# EAGLE design TGE NEIL v1 (EAGLE 9.6.2)

## Sheet 1 of 5: TBEAM
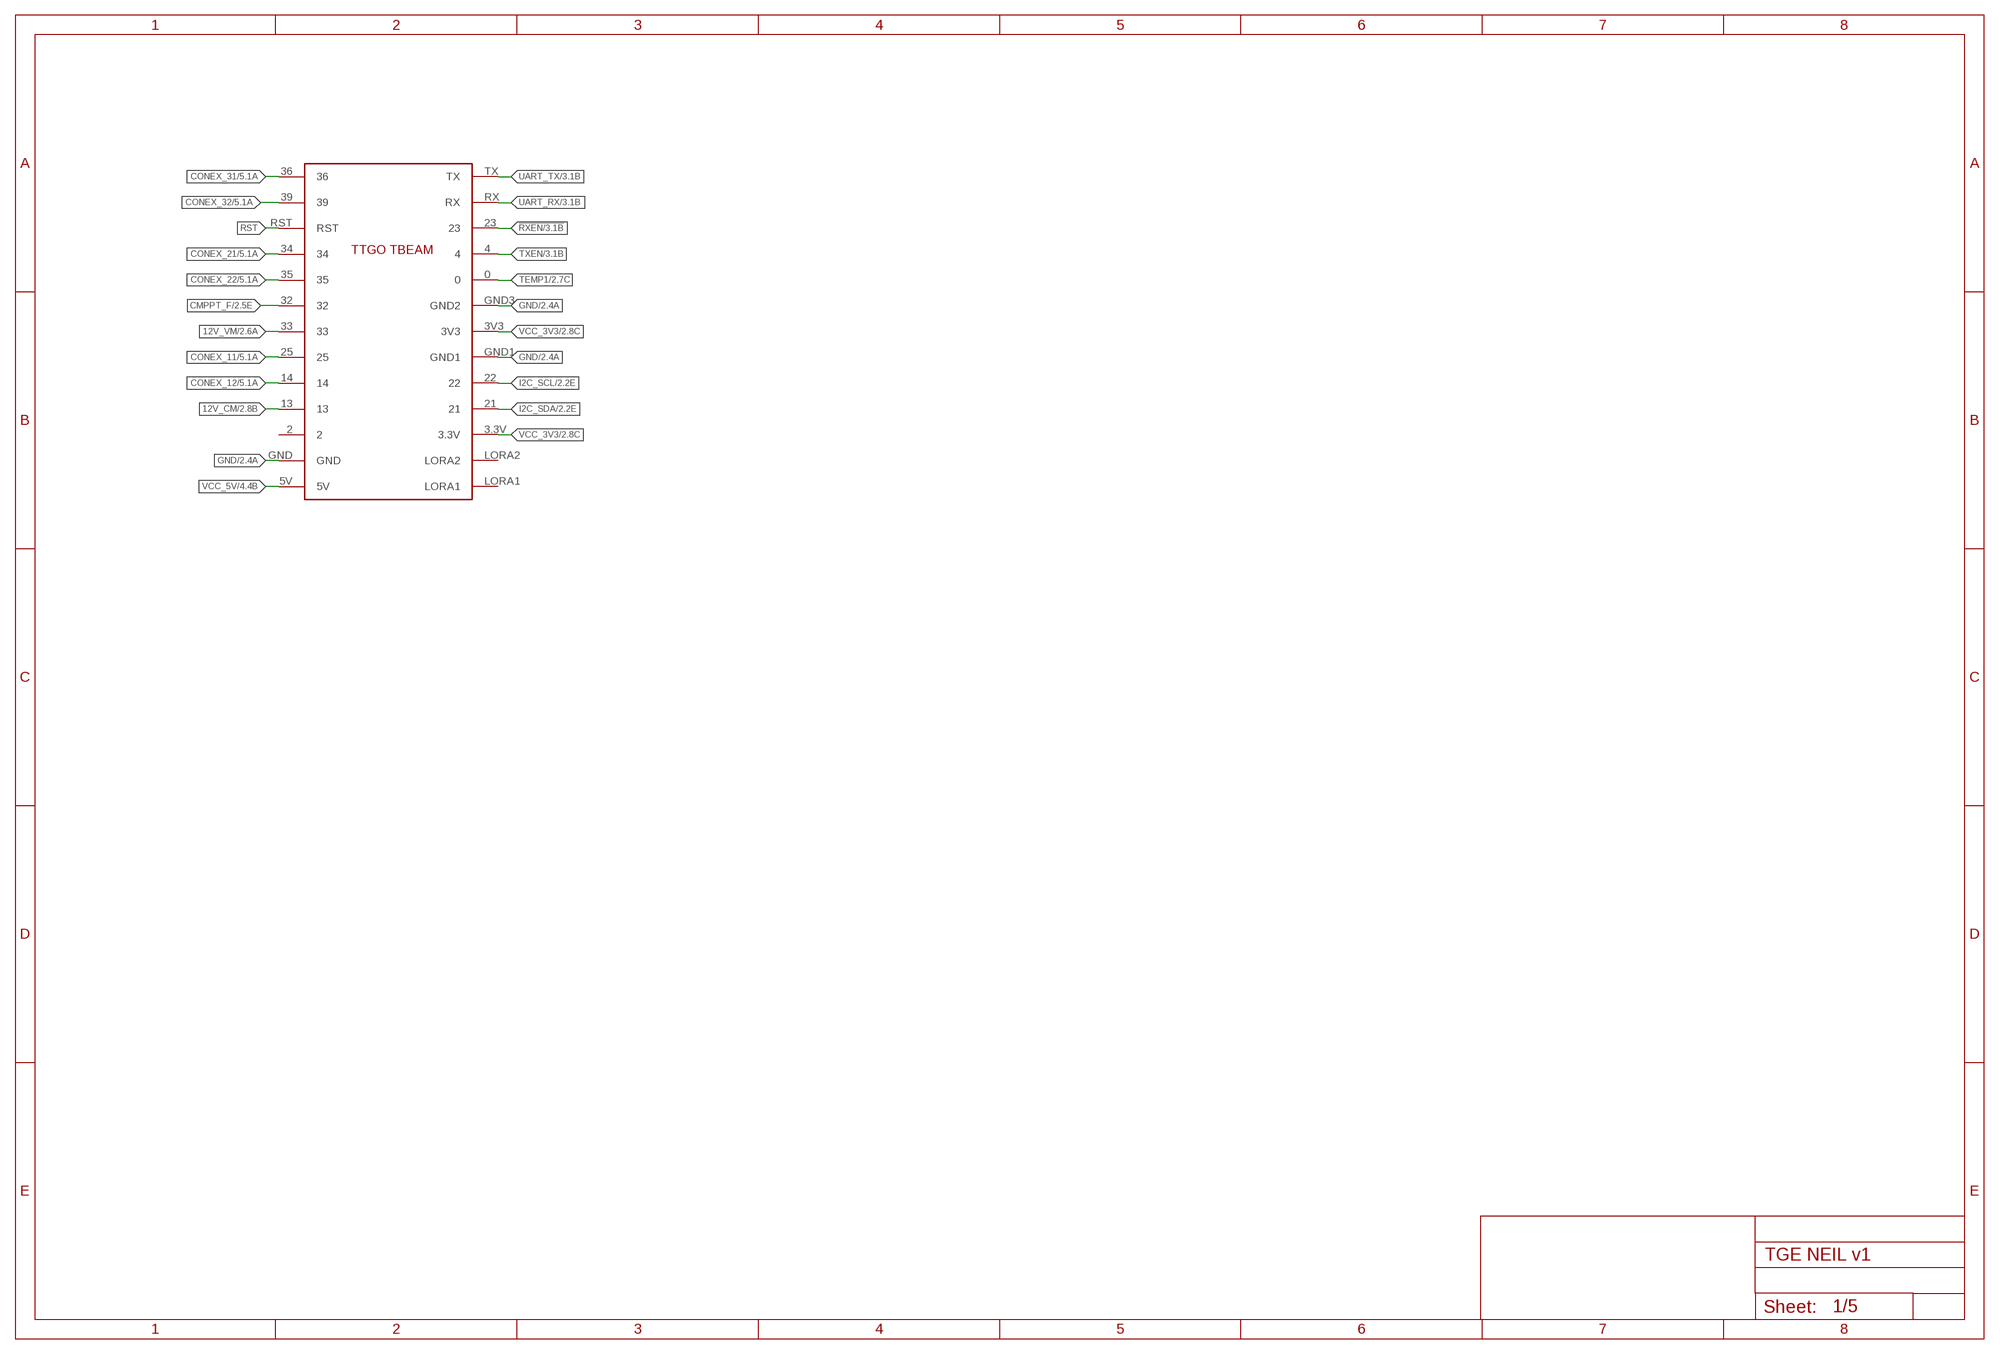
[diagram p0: schematic, sheet 1]

### Parts
U$1  TTGOBEAM  [TTGOBEAM]

### Nets
12V_CM: U$1.13 ; also sheet 2
12V_VM: U$1.33 ; also sheet 2
!RXEN: U$1.23 ; also sheet 3
CMPPT_F: U$1.32 ; also sheet 2
CONEX_11: U$1.25 ; also sheet 5
CONEX_12: U$1.14 ; also sheet 5
CONEX_21: U$1.34 ; also sheet 5
CONEX_22: U$1.35 ; also sheet 5
CONEX_31: U$1.36 ; also sheet 5
CONEX_32: U$1.39 ; also sheet 5
GND: U$1.GND U$1.GND1 U$1.GND3(GND2) ; also sheet 2,3,4,5
I2C_SCL: U$1.22 ; also sheet 2
I2C_SDA: U$1.21 ; also sheet 2
RST: U$1.RST
TEMP1: U$1.0 ; also sheet 2
TXEN: U$1.4 ; also sheet 3
UART_RX: U$1.RX ; also sheet 3
UART_TX: U$1.TX ; also sheet 3
VCC_3V3: U$1.3.3V U$1.3V3 ; also sheet 2,3,4
VCC_5V: U$1.5V ; also sheet 4,5
Unconnected: U$1.2 U$1.LORA1 U$1.LORA2

## Sheet 2 of 5: Analog Circuits
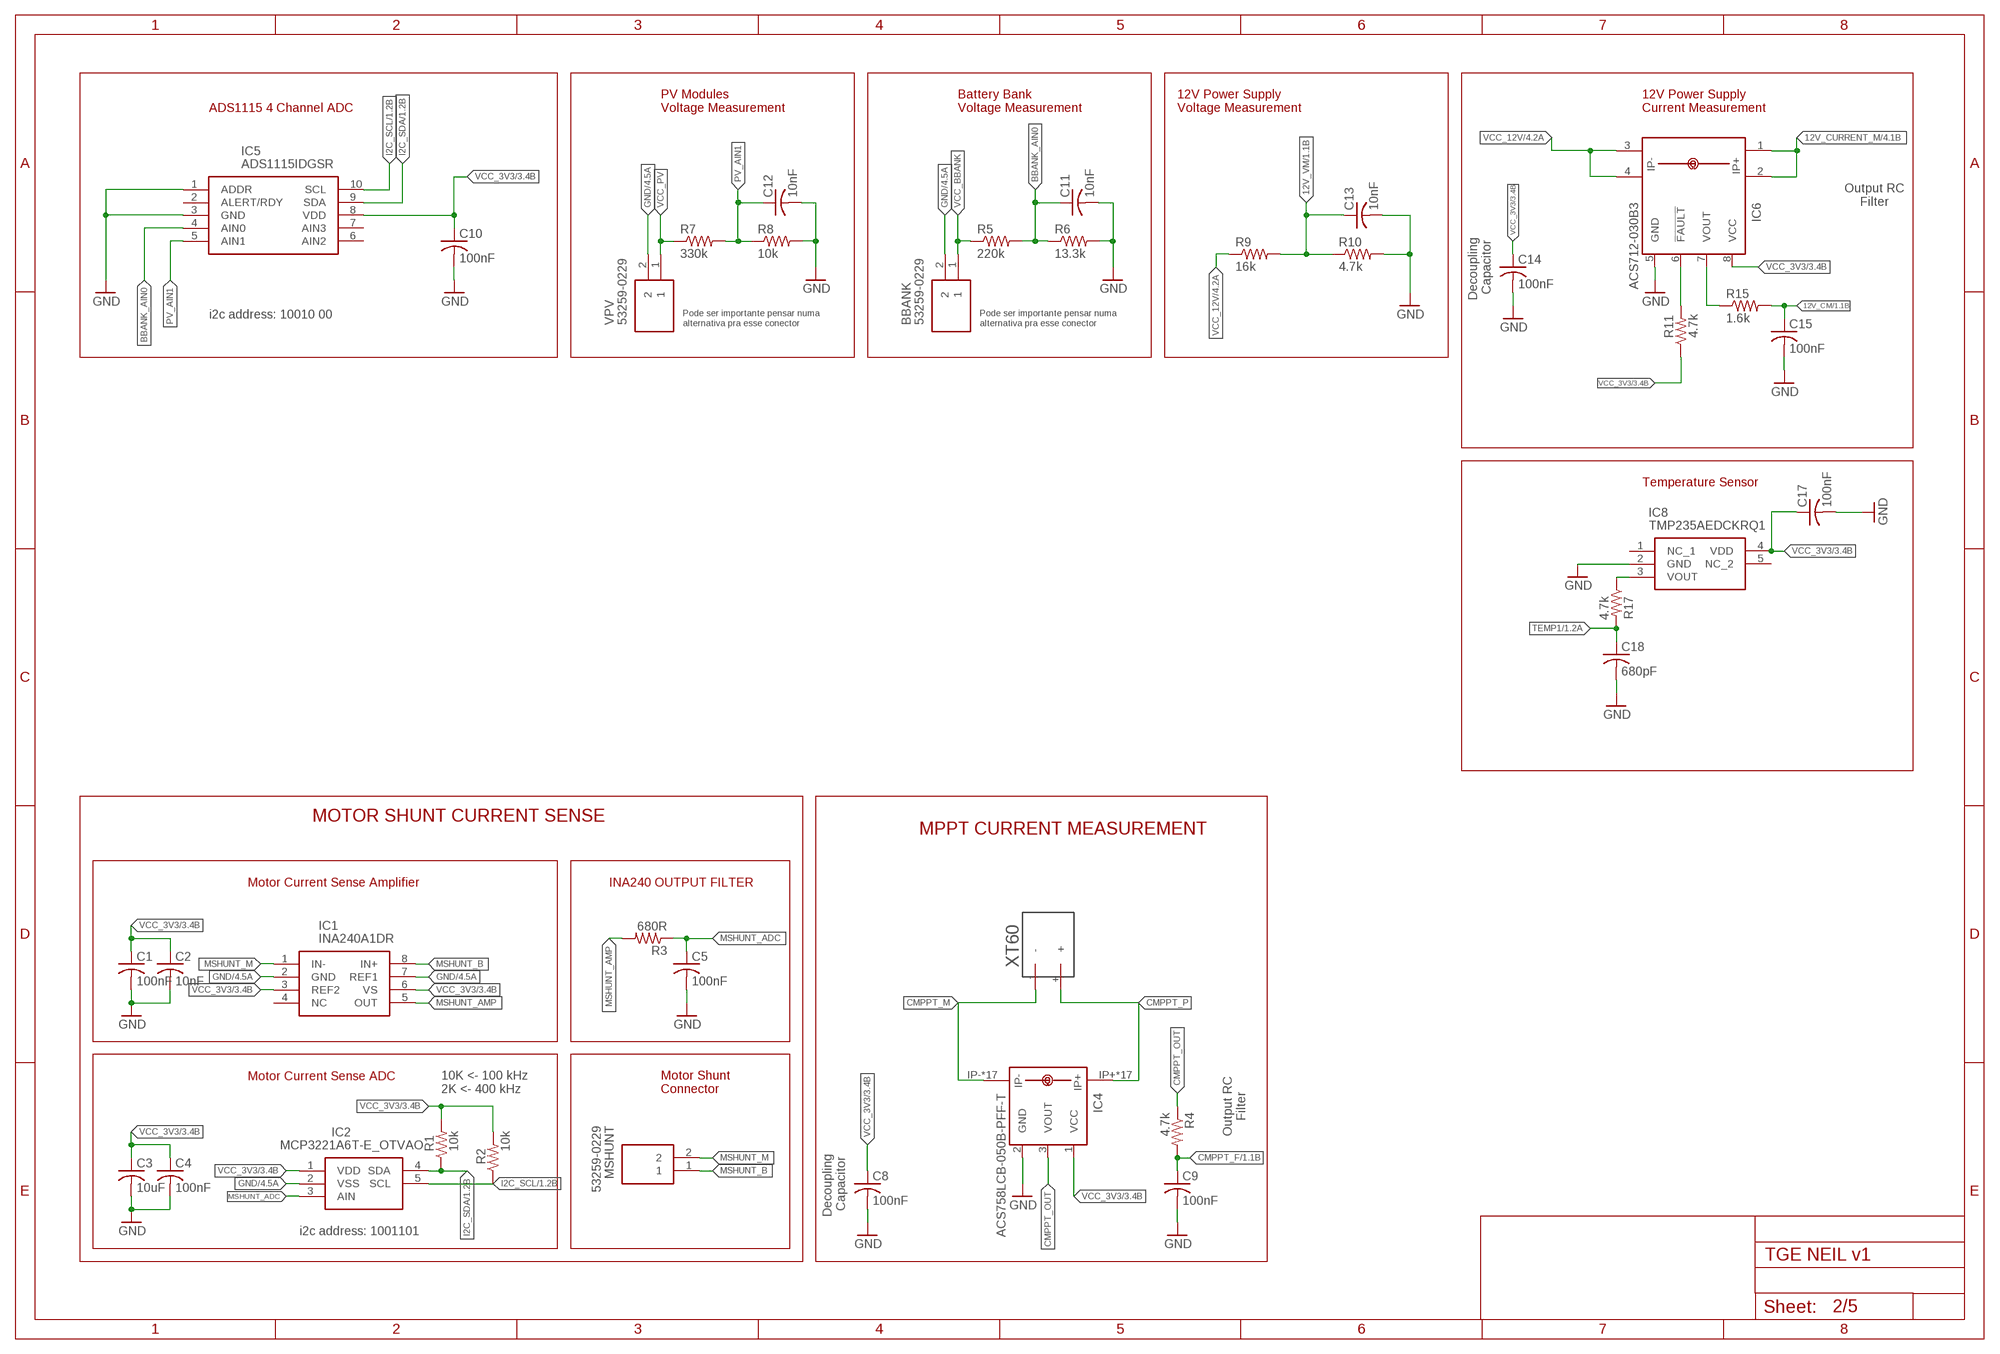
[diagram p1: schematic, sheet 2]

### Parts
BBANK  53259-0229  [0532590229]
C1  100nF  C-USC0805  [C0805]
C2  10nF  C-USC0805  [C0805]
C3  10uF  C-USC0805  [C0805]
C4  100nF  C-USC0805  [C0805]
C5  100nF  C-USC0805  [C0805]
C8  100nF  C-USC0805  [C0805]
C9  100nF  C-USC0805  [C0805]
C10  100nF  C-USC0805  [C0805]
C11  10nF  C-USC0805  [C0805]
C12  10nF  C-USC0805  [C0805]
C13  10nF  C-USC0805  [C0805]
C14  100nF  C-USC0805  [C0805]
C15  100nF  C-USC0805  [C0805]
C17  100nF  C-USC0805  [C0805]
C18  680pF  C-USC0805  [C0805]
IC1  INA240A1DR  [SOIC127P600X175-8N]
IC2  MCP3221A6T-E_OTVAO  [SOT95P280X145-5N]
IC4  ACS758LCB-050B-PFF-T  [CB-PFF]
IC5  ADS1115IDGSR  [SOP50P490X110-10N]
IC6  ACS712-030B3  ACS712-LC  [SOIC8]
IC8  TMP235AEDCKRQ1  [SOT65P210X110-5N]
MSHUNT  53259-0229  [0532590229]
R1  10k  R-US_R0805  [R0805]
R2  10k  R-US_R0805  [R0805]
R3  680R  R-US_R0805  [R0805]
R4  4.7k  R-US_R0805  [R0805]
R5  220k  R-US_R0805  [R0805]
R6  13.3k  R-US_R0805  [R0805]
R7  330k  R-US_R0805  [R0805]
R8  10k  R-US_R0805  [R0805]
R9  16k  R-US_R0805  [R0805]
R10  4.7k  R-US_R0805  [R0805]
R11  4.7k  R-US_R0805  [R0805]
R15  1.6k  R-US_R0805  [R0805]
R17  4.7k  R-US_R0805  [R0805]
U$3  XT60  [XT60]
VPV  53259-0229  [0532590229]

### Nets
12V_CM: C15.1 R15.2 ; also sheet 1
12V_CURRENT_M: IC6.1(IP+) IC6.2(IP+1) ; also sheet 4
12V_VM: C13.1 R9.2 R10.1 ; also sheet 1
BBANK_AIN0: C11.1 IC5.4(AIN0) R5.2 R6.1
CMPPT_F: C9.1 R4.2 ; also sheet 1
CMPPT_M: IC4.IP- IC4.IP-@2(IP-) IC4.IP-@3(IP-) IC4.IP-@4(IP-) IC4.IP-@5(IP-) IC4.IP-@6(IP-) IC4.IP-@7(IP-) IC4.IP-@8(IP-) IC4.IP-@9(IP-) IC4.IP-@10(IP-) IC4.IP-@11(IP-) IC4.IP-@12(IP-) IC4.IP-@13(IP-) IC4.IP-@14(IP-) IC4.IP-@15(IP-) IC4.IP-@16(IP-) IC4.IP-@17(IP-) U$3.-
CMPPT_OUT: IC4.3(VOUT) R4.1
CMPPT_P: IC4.IP+ IC4.IP+@2(IP+) IC4.IP+@3(IP+) IC4.IP+@4(IP+) IC4.IP+@5(IP+) IC4.IP+@6(IP+) IC4.IP+@7(IP+) IC4.IP+@8(IP+) IC4.IP+@9(IP+) IC4.IP+@10(IP+) IC4.IP+@11(IP+) IC4.IP+@12(IP+) IC4.IP+@13(IP+) IC4.IP+@14(IP+) IC4.IP+@15(IP+) IC4.IP+@16(IP+) IC4.IP+@17(IP+) U$3.+
GND: BBANK.2 C1.2 C2.2 C3.2 C4.2 C5.2 C8.2 C9.2 C10.2 C11.2 C12.2 C13.2 C14.2 C15.2 C17.2 C18.2 IC1.2(GND) IC1.7(REF1) IC2.2(VSS) IC4.2(GND) IC5.1(ADDR) IC5.3(GND) IC6.5(GND) IC8.2(GND) R6.2 R8.2 R10.2 VPV.2 ; also sheet 1,3,4,5
I2C_SCL: IC2.5(SCL) IC5.10(SCL) R2.1 ; also sheet 1
I2C_SDA: IC2.4(SDA) IC5.9(SDA) R1.1 ; also sheet 1
MSHUNT_ADC: C5.1 IC2.3(AIN) R3.1
MSHUNT_AMP: IC1.5(OUT) R3.2
MSHUNT_B: IC1.8(IN+) MSHUNT.1
MSHUNT_M: IC1.1(IN-) MSHUNT.2
N$1: IC6.6(!FAULT) R11.2
N$2: IC6.7(VOUT) R15.1
N$3: IC8.3(VOUT) R17.1
PV_AIN1: C12.1 IC5.5(AIN1) R7.2 R8.1
TEMP1: C18.1 R17.2 ; also sheet 1
VCC_3V3: C1.1 C2.1 C3.1 C4.1 C8.1 C10.1 C14.1 C17.1 IC1.3(REF2) IC1.6(VS) IC2.1(VDD) IC4.1(VCC) IC5.8(VDD) IC6.8(VCC) IC8.4(VDD) R1.2 R2.2 R11.1 ; also sheet 1,3,4
VCC_12V: IC6.3(IP-) IC6.4(IP-1) R9.1 ; also sheet 4
VCC_BBANK: BBANK.1 R5.1
VCC_PV: R7.1 VPV.1
Unconnected: IC1.4(NC) IC5.2(ALERT/RDY) IC5.6(AIN2) IC5.7(AIN3) IC8.1(NC_1) IC8.5(NC_2)

### Notes on the sheet
- ADS1115 4 Channel ADC
- PV Modules
  Voltage Measurement
- Battery Bank
  Voltage Measurement
- 12V Power Supply
  Voltage Measurement
- 12V Power Supply
  Current Measurement
- Output RC
  Filter
- Decoupling 
  Capacitor
- i2c address: 10010 00
- Pode ser importante pensar numa
  alternativa pra esse conector
- Pode ser importante pensar numa
  alternativa pra esse conector
- Temperature Sensor
- MOTOR SHUNT CURRENT SENSE
- MPPT CURRENT MEASUREMENT
- Motor Current Sense Amplifier | INA240 OUTPUT FILTER
- Motor Current Sense ADC
- 10K <- 100 kHz
  2K <- 400 kHz
- Motor Shunt 
  Connector
- Output RC
  Filter
- Decoupling 
  Capacitor
- i2c address: 1001101

## Sheet 3 of 5: Communication
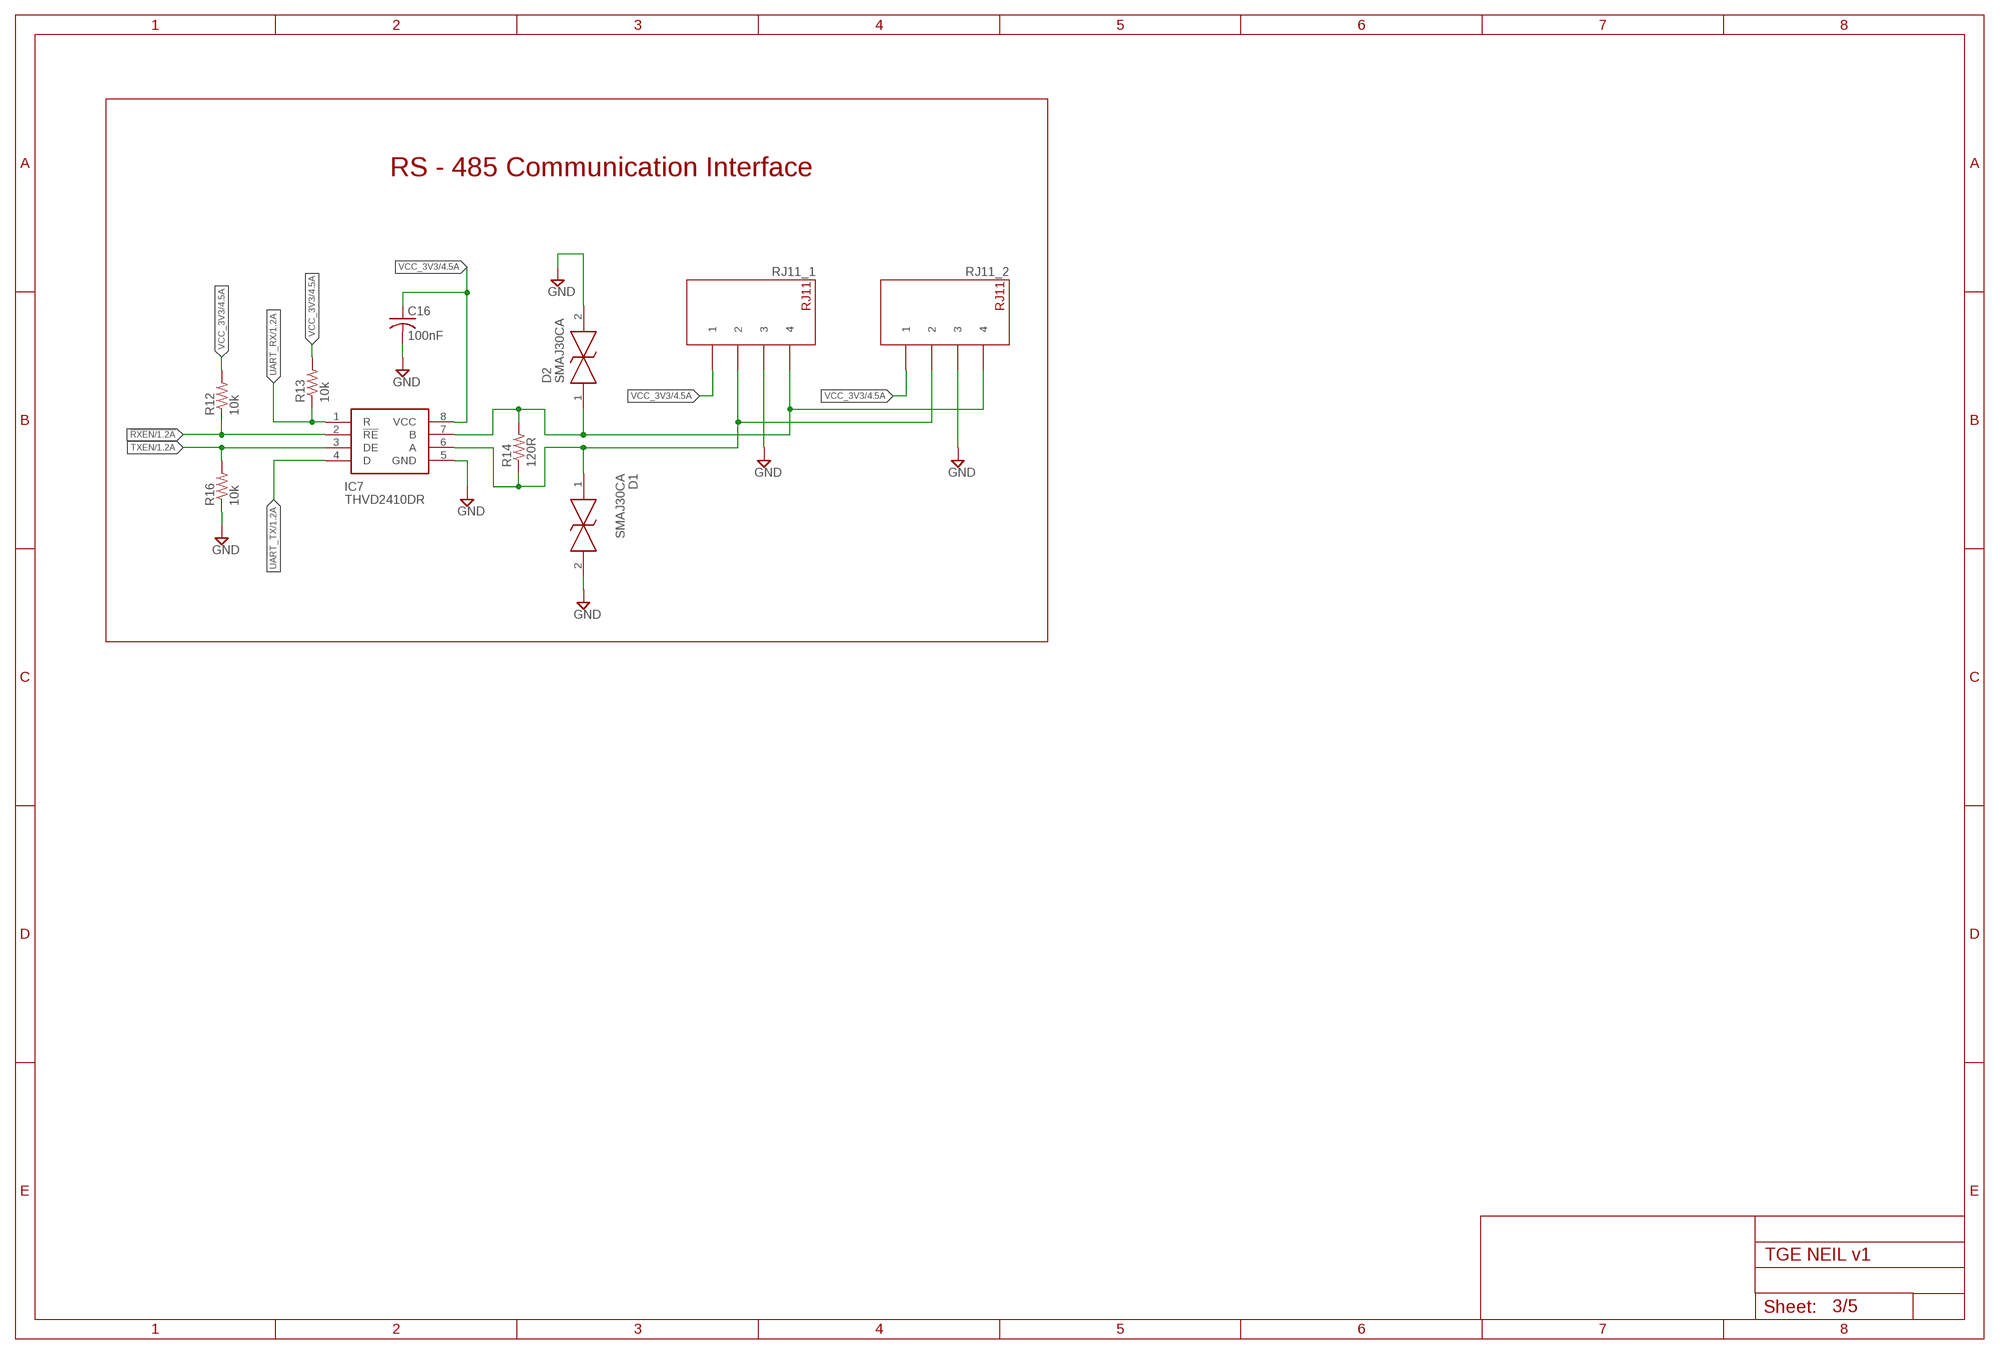
[diagram p2: schematic, sheet 3]

### Parts
C16  100nF  C-USC0805  [C0805]
D1  SMAJ30CA  [DIONM5026X229N]
D2  SMAJ30CA  [DIONM5026X229N]
IC7  THVD2410DR  [SOIC127P600X175-8N]
R12  10k  R-US_M0805  [M0805]
R13  10k  R-US_M0805  [M0805]
R14  120R  R-US_M0805  [M0805]
R16  10k  R-US_M0805  [M0805]
RJ11_1  TFC44  [TFC44]
RJ11_2  TFC44  [TFC44]

### Nets
!RXEN: IC7.2(!RE) R12.1 ; also sheet 1
GND: C16.2 D1.2 D2.2 IC7.5(GND) R16.1 RJ11_1.P$3 RJ11_2.P$3 ; also sheet 1,2,4,5
RS485_A: D1.1 IC7.6(A) R14.1 RJ11_1.P$2 RJ11_2.P$2
RS485_B: D2.1 IC7.7(B) R14.2 RJ11_1.P$4 RJ11_2.P$4
TXEN: IC7.3(DE) R16.2 ; also sheet 1
UART_RX: IC7.1(R) R13.1 ; also sheet 1
UART_TX: IC7.4(D) ; also sheet 1
VCC_3V3: C16.1 IC7.8(VCC) R12.2 R13.2 RJ11_1.P$1 RJ11_2.P$1 ; also sheet 1,2,4

### Notes on the sheet
- RS - 485 Communication Interface

## Sheet 4 of 5: Power
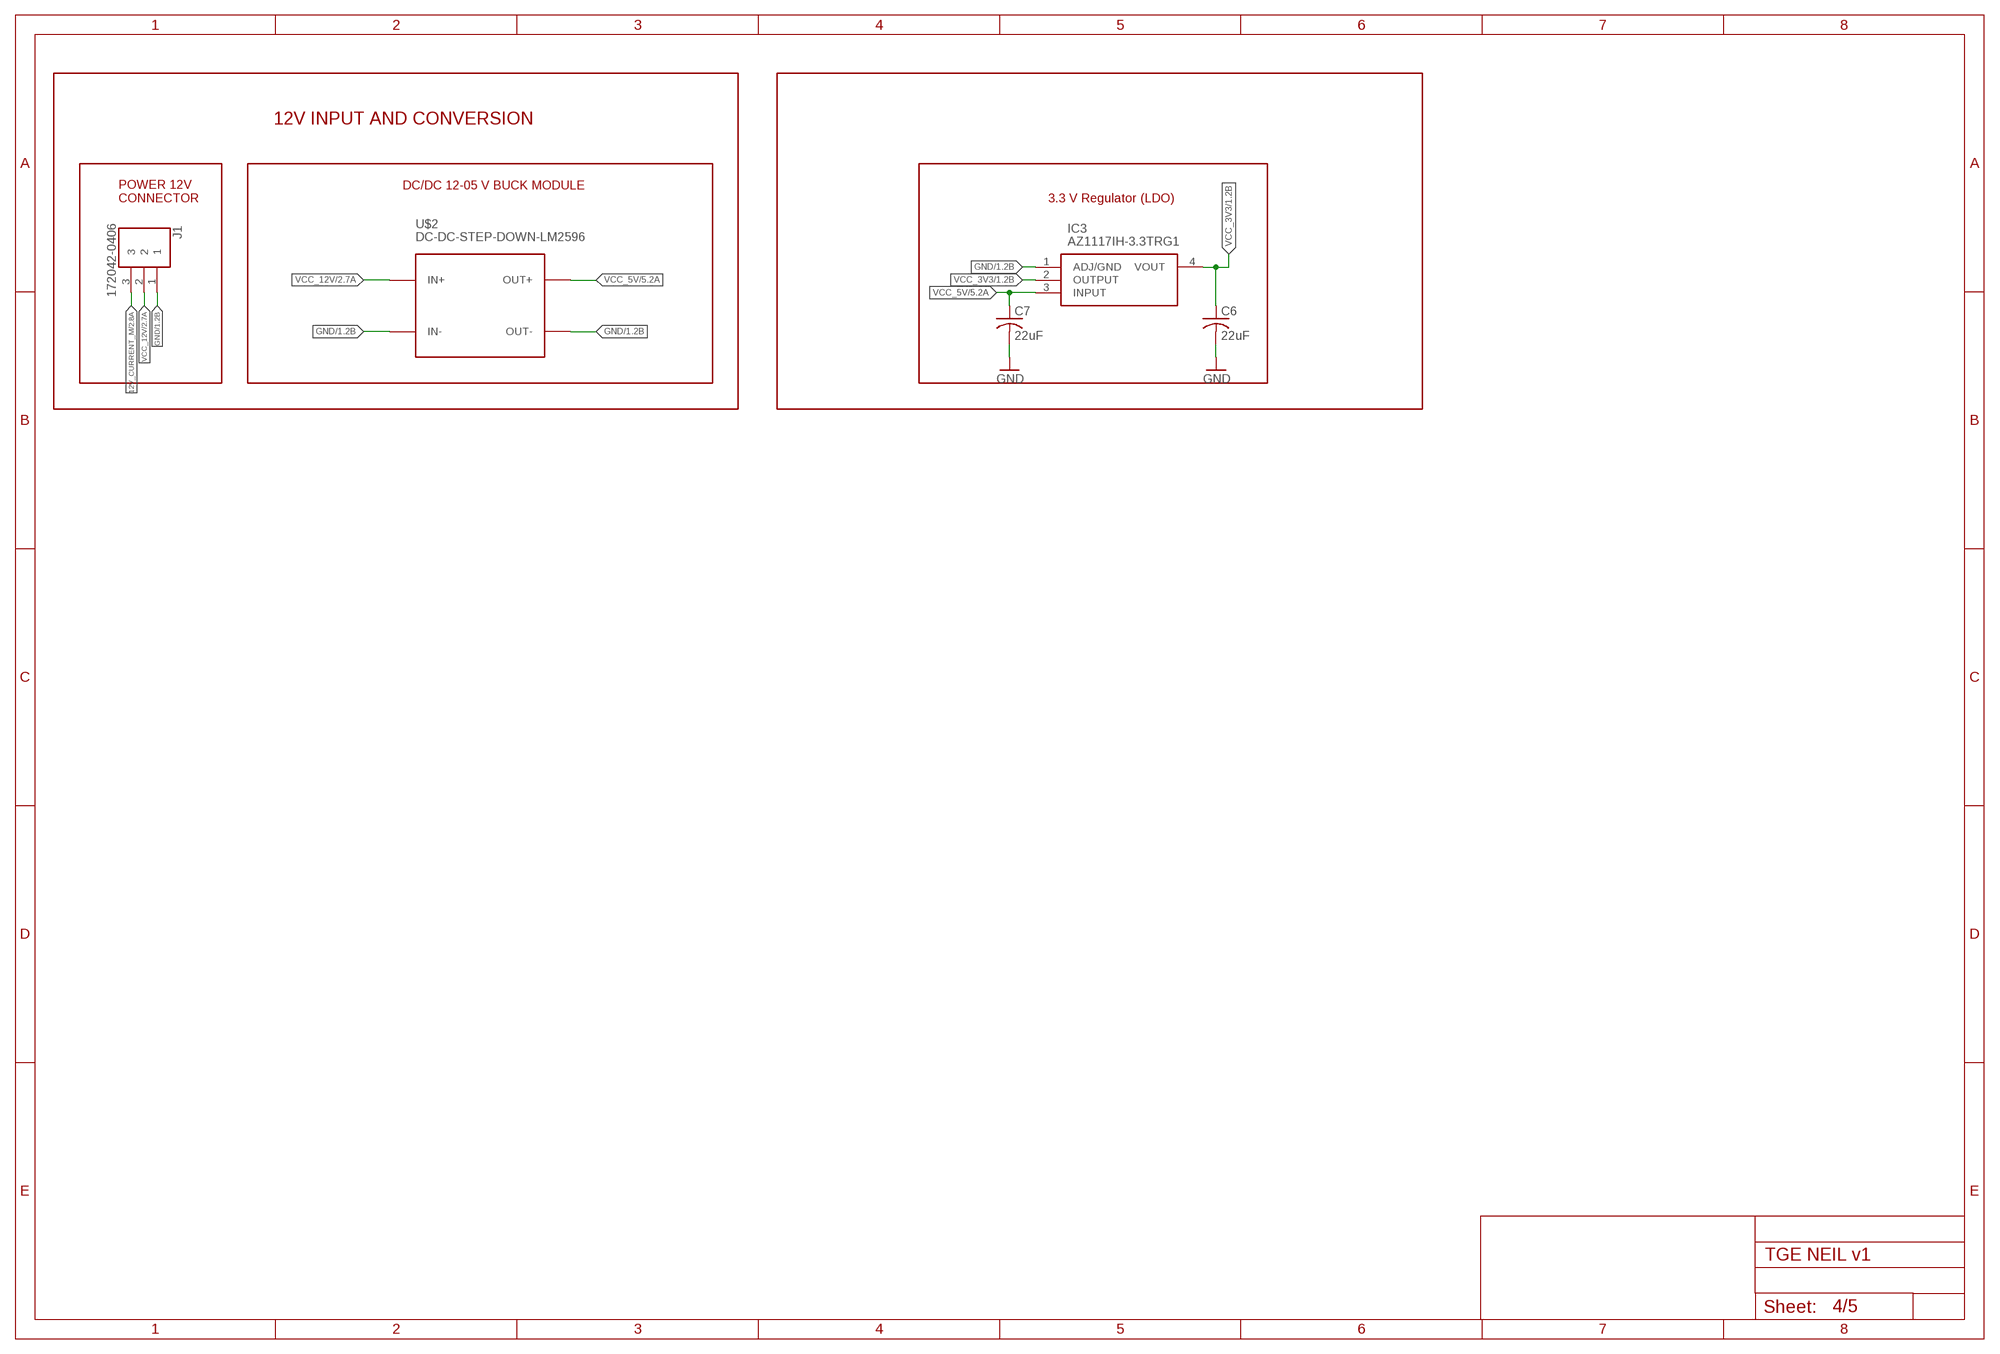
[diagram p3: schematic, sheet 4]

### Parts
C6  22uF  C-USC0805  [C0805]
C7  22uF  C-USC0805  [C0805]
IC3  AZ1117IH-3.3TRG1  [SOT230P700X170-4N]
J1  172042-0406  [MOLEX_172042-0406]
U$2  DC-DC-STEP-DOWN-LM2596  [DC-DC-STEP-DOWN-LM2596]

### Nets
12V_CURRENT_M: J1.3 ; also sheet 2
GND: C6.2 C7.2 IC3.1(ADJ/GND) J1.1 U$2.IN- U$2.OUT- ; also sheet 1,2,3,5
VCC_3V3: C6.1 IC3.2(OUTPUT) IC3.4(VOUT) ; also sheet 1,2,3
VCC_5V: C7.1 IC3.3(INPUT) U$2.OUT+ ; also sheet 1,5
VCC_12V: J1.2 U$2.IN+ ; also sheet 2

### Notes on the sheet
- 12V INPUT AND CONVERSION
- DC/DC 12-05 V BUCK MODULE
- POWER 12V
  CONNECTOR
- 3.3 V Regulator (LDO)

## Sheet 5 of 5: Extra Connectors
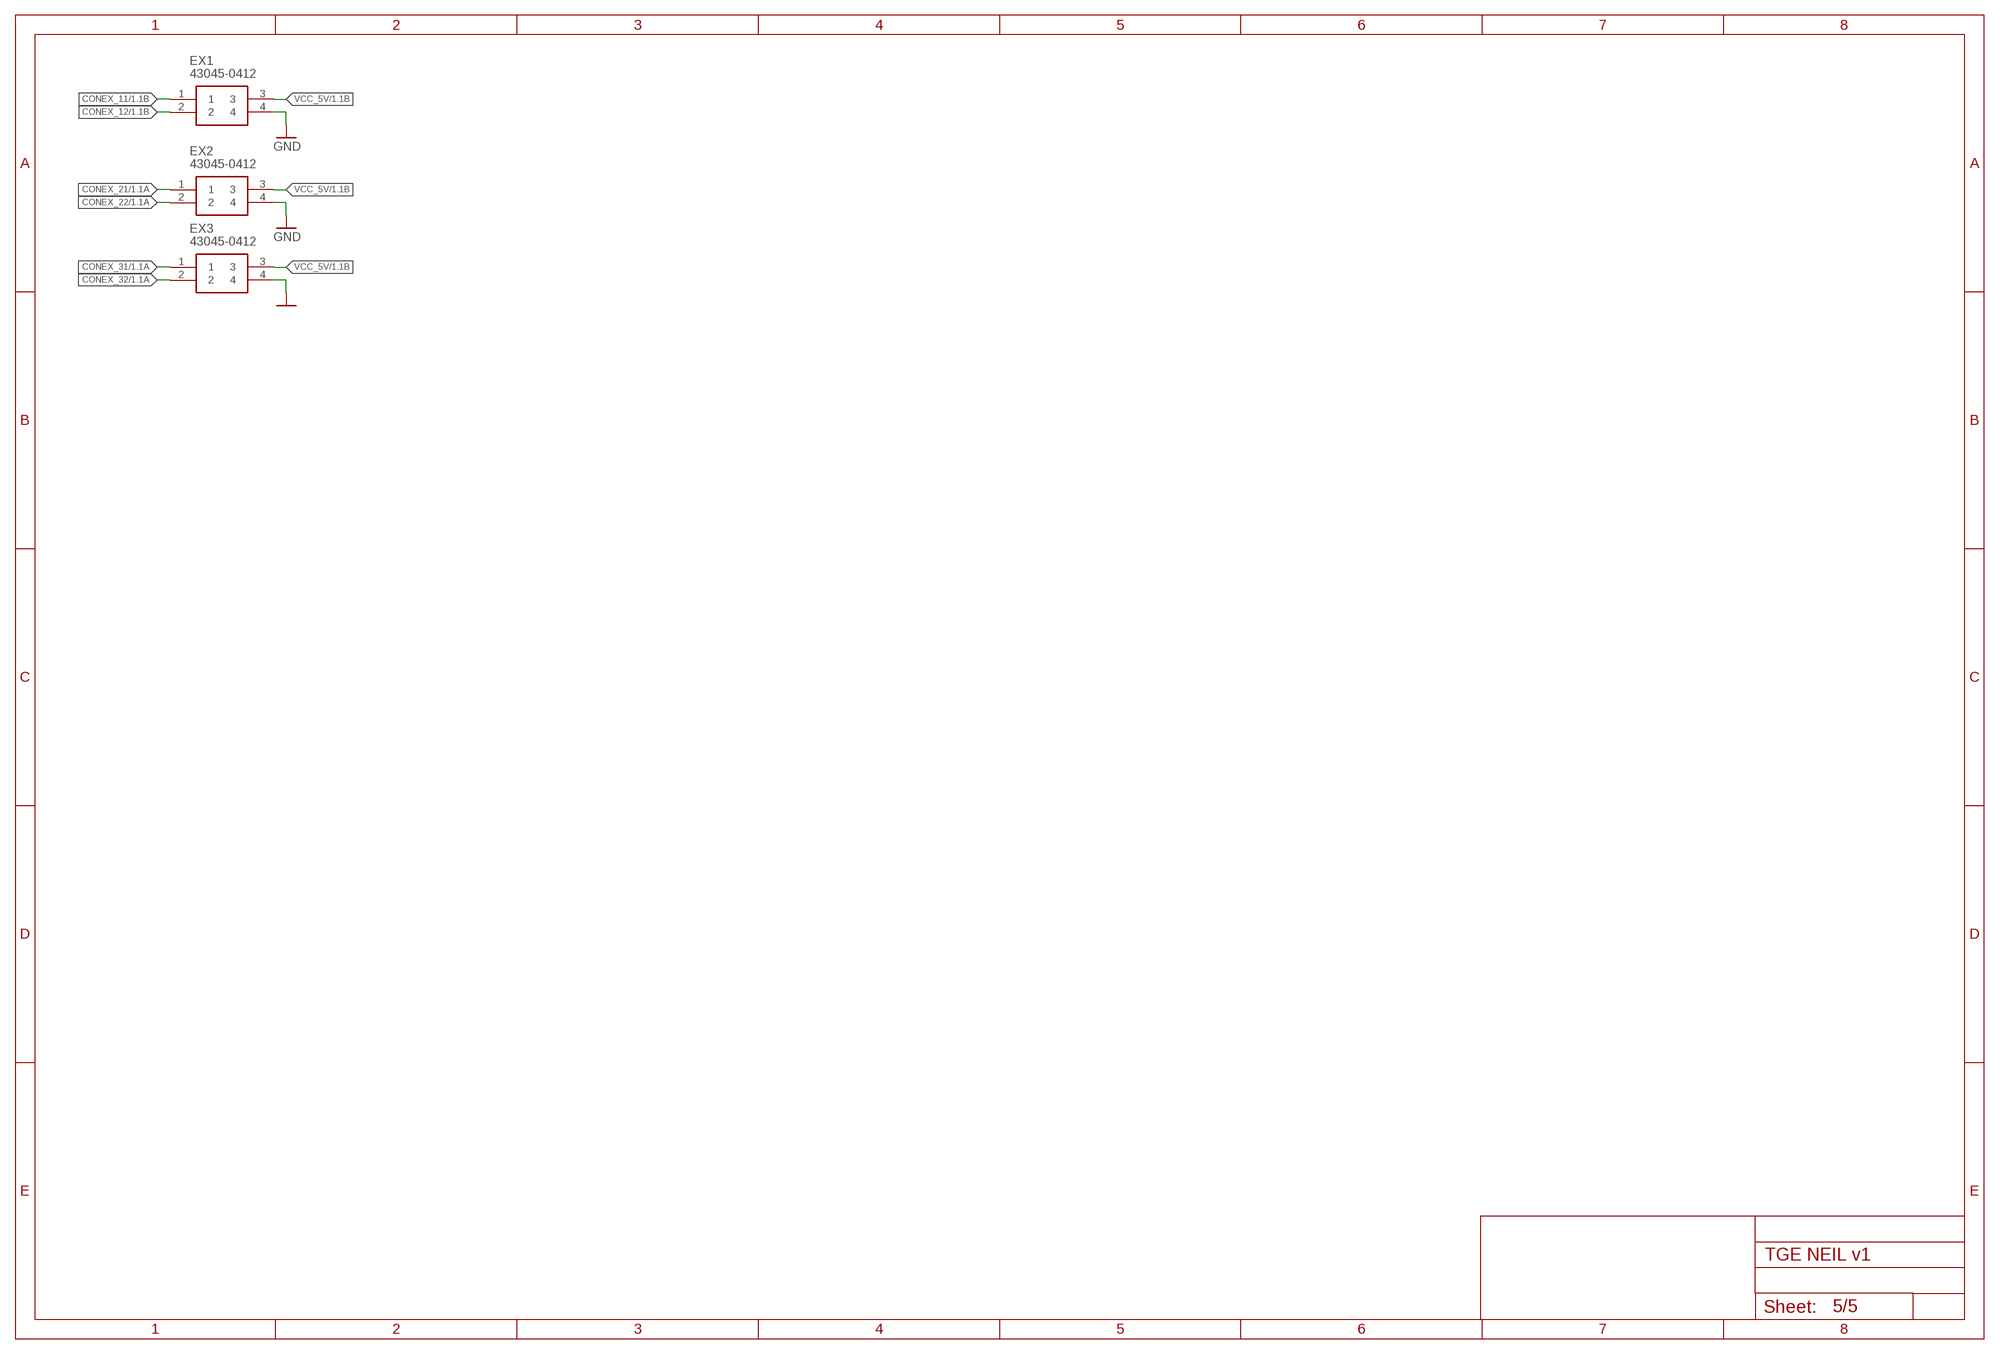
[diagram p4: schematic, sheet 5]

### Parts
EX1  43045-0412  [43045-0412]
EX2  43045-0412  [43045-0412]
EX3  43045-0412  [43045-0412]

### Nets
CONEX_11: EX1.1 ; also sheet 1
CONEX_12: EX1.2 ; also sheet 1
CONEX_21: EX2.1 ; also sheet 1
CONEX_22: EX2.2 ; also sheet 1
CONEX_31: EX3.1 ; also sheet 1
CONEX_32: EX3.2 ; also sheet 1
GND: EX1.4 EX2.4 EX3.4 ; also sheet 1,2,3,4
VCC_5V: EX1.3 EX2.3 EX3.3 ; also sheet 1,4

## Library data of the parts
BBANK MSHUNT VPV = CON_MOLEX_53259-0229:53259-0229: Headers & Wire Housings 3.5 WtB Wafer Assy R B Wafer Assy RA 2Ckt Source: Datasheet <https://www.molex.com/webdocs/datasheets/pdf/en-us/0532590229_PCB_HEADERS.pdf>; DESCRIPTION: Headers & Wire Housings 3.5 WtB Wafer Assy R B Wafer Assy RA 2Ckt; HEIGHT: 7mm; MANUFACTURER_NAME: Molex; MANUFACTURER_PART_NUMBER: 53259-0229; MOUSER_PART_NUMBER: 538-53259-0229; MOUSER_PRICE-STOCK: https://www.mouser.co.uk/ProductDetail/Molex/53259-0229?qs=%2Fy5FSpUmAiGN4PmFvaThpA%3D%3D
C1-C18 = rcl:C-US: CAPACITOR, American symbol; SPICEPREFIX: C
D1 D2 = SamacSys_Parts:SMAJ30CA: Littelfuse SMAJ30CA, Bi-Directional TVS Diode, 400W, 2-Pin DO-214AC Source: Datasheet <https://www.mouser.se/datasheet/2/240/Littelfuse_TVS_Diode_SMAJ_Datasheet.pdf-540740.pdf>; DESCRIPTION: Littelfuse SMAJ30CA, Bi-Directional TVS Diode, 400W, 2-Pin DO-214AC; HEIGHT: 2.29mm; MANUFACTURER_NAME: LITTELFUSE; MANUFACTURER_PART_NUMBER: SMAJ30CA; MOUSER_PART_NUMBER: 576-SMAJ30CA; MOUSER_PRICE-STOCK: https://www.mouser.co.uk/ProductDetail/Littelfuse/SMAJ30CA?qs=HR2RnyOI4E7JQai5qAA1IA%3D%3D
EX1-EX3 = SamacSys_Parts:43045-0412: Headers & Wire Housings 4 CKT VERT HEADER Source: Datasheet; DESCRIPTION: Headers & Wire Housings 4 CKT VERT HEADER; HEIGHT: mm; MANUFACTURER_NAME: Molex; MANUFACTURER_PART_NUMBER: 43045-0412; MOUSER_PART_NUMBER: 538-43045-0412; MOUSER_PRICE-STOCK: https://www.mouser.co.uk/ProductDetail/Molex/43045-0412?qs=UeCeOHRHQebPBbEMDLocEw%3D%3D
IC1 = INA240A1DR:INA240A1DR: 80V, Low-/High-Side, Bi-Directional, Zero-Drift, Current Sense Amp w/Enhanced PWM Rejection Source: Datasheet <http://www.ti.com/lit/gpn/ina240>; DESCRIPTION: 80V, Low-/High-Side, Bi-Directional, Zero-Drift, Current Sense Amp w/Enhanced PWM Rejection; HEIGHT: 1.75mm; MANUFACTURER_NAME: Texas Instruments; MANUFACTURER_PART_NUMBER: INA240A1DR; MOUSER_PART_NUMBER: 595-INA240A1DR; MOUSER_PRICE-STOCK: https://www.mouser.co.uk/ProductDetail/Texas-Instruments/INA240A1DR?qs=AQlKX63v8Rv7XB07RTzuHA%3D%3D
IC2 = MCP3221A6T-E_OTVAO:MCP3221A6T-E_OTVAO: Analog to Digital Converters - ADC Automotive, 12-bit SAR ADC, I2C, single channel Source: Datasheet <https://www.arrow.com/en/products/mcp3221a6t-eotvao/microchip-technology>; DESCRIPTION: Analog to Digital Converters - ADC Automotive, 12-bit SAR ADC, I2C, single channel; HEIGHT: 1.45mm; MANUFACTURER_NAME: Microchip; MANUFACTURER_PART_NUMBER: MCP3221A6T-E/OTVAO; MOUSER_PART_NUMBER: 579-MCP3221A6TEOTVAO; MOUSER_PRICE-STOCK: https://www.mouser.co.uk/ProductDetail/Microchip-Technology/MCP3221A6T-E-OTVAO?qs=5aG0NVq1C4xIe7K3D%2FHE6g%3D%3D
IC3 = AZ1117IH-3.3TRG1:AZ1117IH-3.3TRG1: LDO Voltage Regulators LDO BJT HiCurr 1.35A 10Hz to 10KHz Source: Datasheet; DESCRIPTION: LDO Voltage Regulators LDO BJT HiCurr 1.35A 10Hz to 10KHz; HEIGHT: 1.7mm; MANUFACTURER_NAME: Diodes Inc.; MANUFACTURER_PART_NUMBER: AZ1117IH-3.3TRG1; MOUSER_PART_NUMBER: 621-AZ1117IH-3.3TRG1; MOUSER_PRICE-STOCK: https://www.mouser.co.uk/ProductDetail/Diodes-Incorporated/AZ1117IH-33TRG1?qs=cpo3%2FpBou2jnS4SxLgAVoA%3D%3D
IC4 = allegro:ACS758*: Thermally Enhanced, Fully Integrated, Hall Effect-Based Linear Current Sensor with 100 micro Ohm Current Conductor display layer 49 Reference in BRD and place VIAs on circles Source: http://www.allegromicro.com/en/Products/Part_Numbers/0758/0758.pdf; MPN: ACS758LCB-050B-PFF-T; OC_FARNELL: 1718997; OC_NEWARK: 04R7131
IC5 = SamacSys_Parts:ADS1115IDGSR: 16-Bit 860SPS 4-Ch Delta-Sigma ADC With PGA, Oscillator, Vref, Comparator, and I2C Source: Datasheet <http://www.ti.com/lit/gpn/ADS1115>; DESCRIPTION: 16-Bit 860SPS 4-Ch Delta-Sigma ADC With PGA, Oscillator, Vref, Comparator, and I2C; HEIGHT: 1.1mm; MANUFACTURER_NAME: Texas Instruments; MANUFACTURER_PART_NUMBER: ADS1115IDGSR; MOUSER_PART_NUMBER: 595-ADS1115IDGSR; MOUSER_PRICE-STOCK: https://www.mouser.co.uk/ProductDetail/Texas-Instruments/ADS1115IDGSR?qs=IK5e5L0zOXjKCJoVMhYO%2FQ%3D%3D
IC6 = allegro-2:ACS712-LC
IC7 = SamacSys_Parts:THVD2410DR: RS-485 Interface IC Source: Datasheet <https://www.ti.com/lit/ds/symlink/thvd2410.pdf>; DESCRIPTION: RS-485 Interface IC; HEIGHT: 1.75mm; MANUFACTURER_NAME: Texas Instruments; MANUFACTURER_PART_NUMBER: THVD2410DR; MOUSER_PART_NUMBER: 595-THVD2410DR; MOUSER_PRICE-STOCK: https://www.mouser.co.uk/ProductDetail/Texas-Instruments/THVD2410DR?qs=%252B6g0mu59x7L2L8jrQVCEYQ%3D%3D
IC8 = SamacSys_Parts:TMP235AEDCKRQ1: Board Mount Temperature Sensors Automotive grade, +/-0.5C analog output temperature sensor with 10 mV/C gain 5-SC70 -40 to 150 Source: Datasheet <https://www.ti.com/lit/gpn/TMP235-Q1>; DESCRIPTION: Board Mount Temperature Sensors Automotive grade, +/-0.5C analog output temperature sensor with 10 mV/C gain 5-SC70 -40 to 150; HEIGHT: 1.1mm; MANUFACTURER_NAME: Texas Instruments; MANUFACTURER_PART_NUMBER: TMP235AEDCKRQ1; MOUSER_PART_NUMBER: 595-TMP235AEDCKRQ1; MOUSER_PRICE-STOCK: https://www.mouser.co.uk/ProductDetail/Texas-Instruments/TMP235AEDCKRQ1?qs=T3oQrply3y86j8c6PmMwyA%3D%3D
J1 = 172042-0302:172042-0406: Super Sabre™ Vertical Header, 3 Circuit, Short Tail with Board Lock, Complies with the UL1977 finger proof stan; AVAILABILITY: Warning; DESCRIPTION: 3 Position Header, Male Blades Connector Solder 0.295 (7.50mm) Through Hole; MF: Molex; MP: 172042-0302; PACKAGE: None; PRICE: None
R1-R17 = rcl:R-US_: RESISTOR, American symbol; SPICEPREFIX: R
RJ11_1 RJ11_2 = Painel-Facilidades:TFC44
U$1 = bibliotecattgo:TTGOBEAM
U$2 = diy-modules:DC-DC-STEP-DOWN-LM2596: DC/DC Step-Down Regulator based on LM2596-ADJ chip LM2596 datasheet available here: http://www.ti.com/lit/ds/symlink/lm2596.pdf Click here to find device on ebay.com <http://www.ebay.com/sch/lm2596+power+regulator>
U$3 = XT60:XT60: XT60

## Board
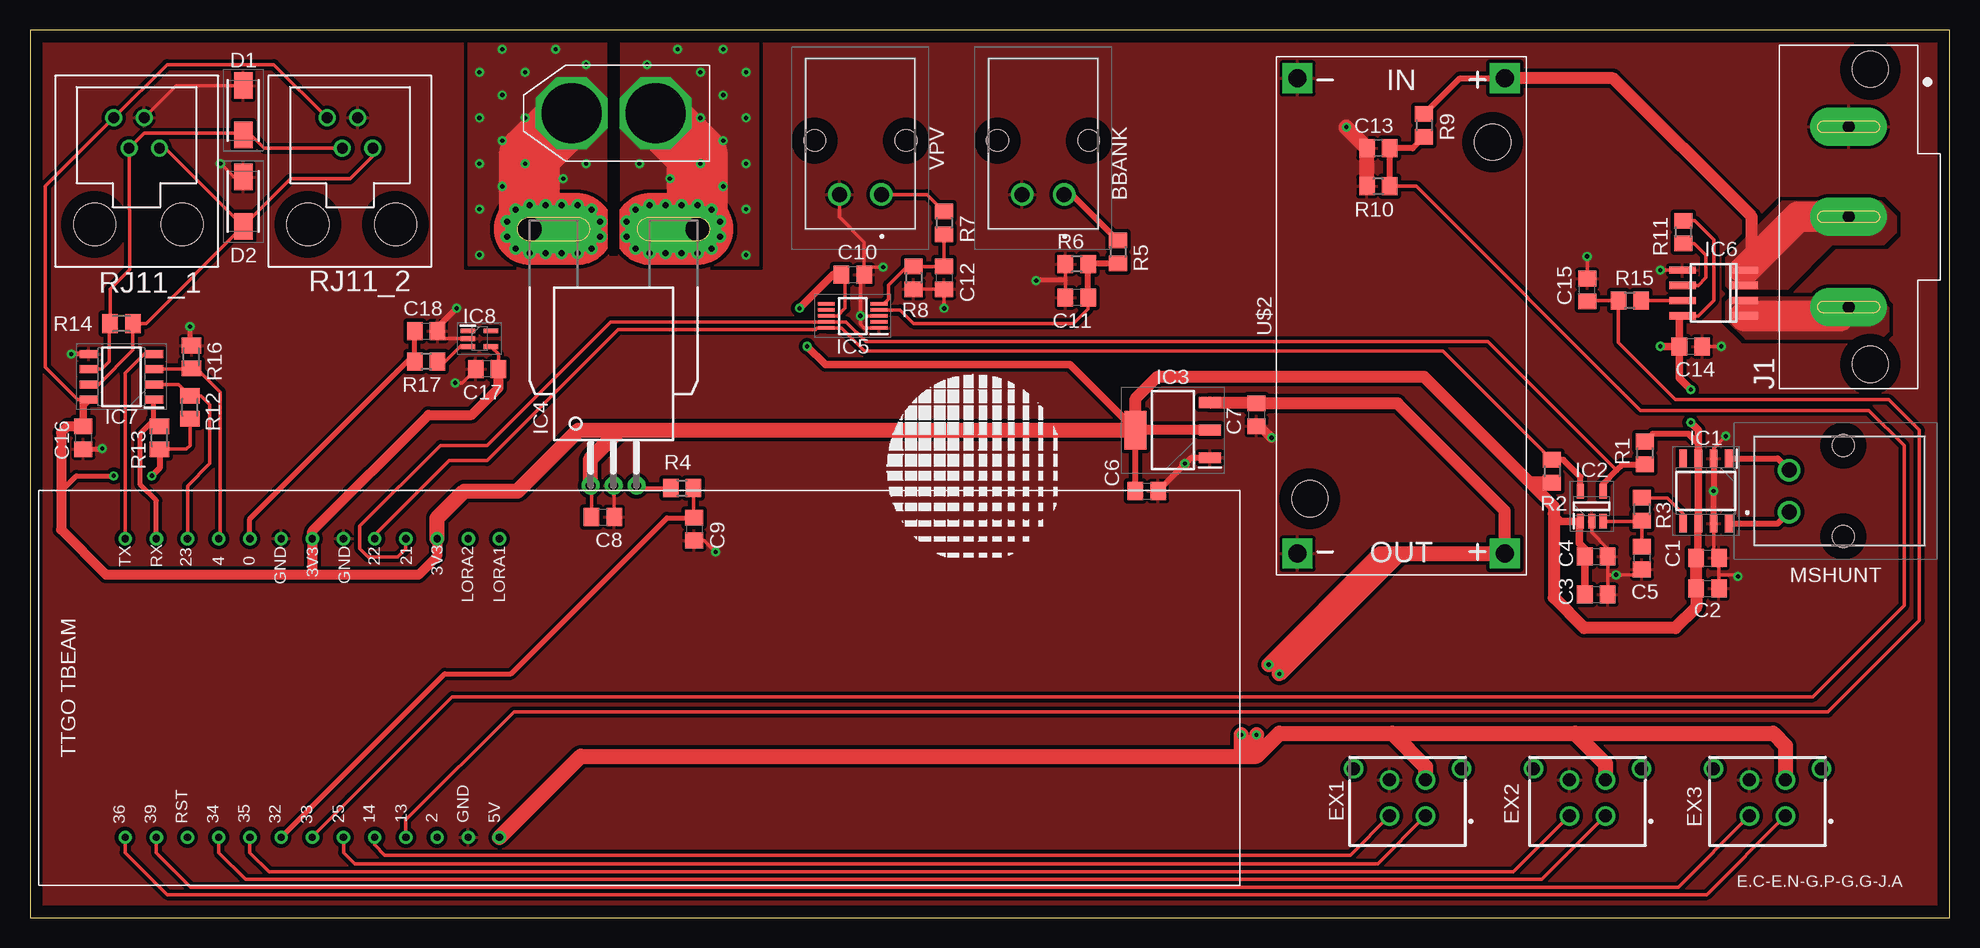
[diagram p5: board, top side]
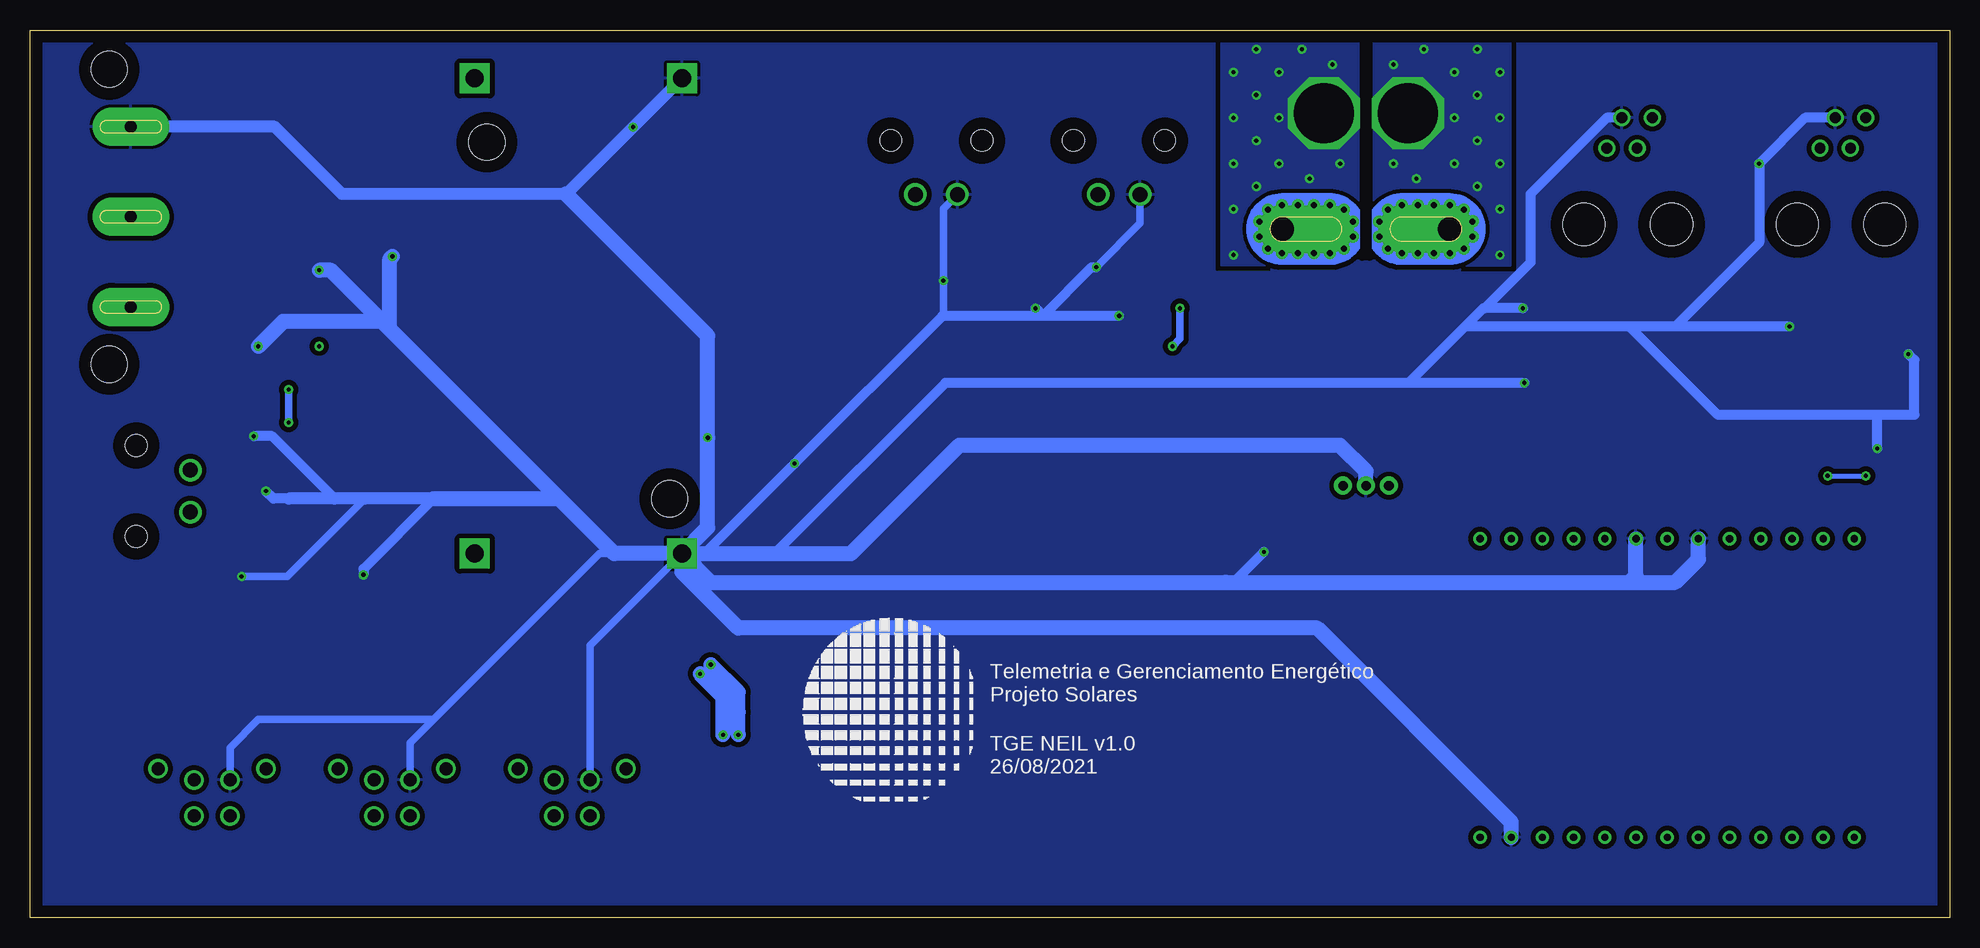
[diagram p6: board, bottom side, seen from below]

Size 160 x 74 mm. Coordinates in mm from the lower left corner, seen from the top.
Outline: 0,0 160,0 160,74 0,74 0,0
Copper layers (1*16): Top 0.07mm / dielectric 1.5mm / Bottom 0.07mm
Design rules "default *": minimum track width 12mil, minimum drill 0.35mm, track to track 12mil, track to pad 16mil, pad to pad 5mil, via to via 16mil, smd to smd 5mil, copper to edge 40mil, drill to drill 6mil, minimum pad ring 10mil, minimum via ring 8mil, stop-mask expansion 4mil, vias tented up to drill 0mil, thermal gap 10mil

### Footprints (pad centres in the part's own frame; a part is rotated, then mirrored left to right if it is on the bottom)
0532590229 = drill 1.25 pad 1.875: 1 -1.75,3.85; 2 1.75,3.85 | hole 1.8: 3.8,-0.65; -3.8,-0.65
C0805 = smd 1.3 x 1.5: 1 -0.95,0; 2 0.95,0
DIONM5026X229N = smd 2.2 x 1.55: 1 -2.05,0; 2 2.05,0
43045-0412 = drill 1.07 pad 1.62: 1 6.325,2.47; 2 3.325,2.47; 3 6.325,5.47; 4 3.325,5.47; 5 0.325,6.41; 6 9.325,6.41
SOIC127P600X175-8N = smd 1.528 x 0.65: 1 -2.711,1.905; 2 -2.711,0.635; 3 -2.711,-0.635; 4 -2.711,-1.905; 5 2.711,-1.905; 6 2.711,-0.635; 7 2.711,0.635; 8 2.711,1.905
SOT95P280X145-5N = smd 1.2 x 0.6: 1 -1.25,0.95; 2 -1.25,0; 3 -1.25,-0.95; 4 1.25,-0.95; 5 1.25,0.95
SOT230P700X170-4N = smd 1.85 x 0.9: 1 -3.1,2.3; 2 -3.1,0; 3 -3.1,-2.3 | smd 1.85 x 3.2: 4 3.1,0
CB-PFF = drill 0.8 pad 1.5: 1 -1.91,-21.4; 2 0,-21.4; 3 1.91,-21.4 | drill 2 pad 4 offset: IP+ 7,0; IP- -7,0 | drill 0.5 pad 0.9: IP+@2 8.89,0.635; IP+@3 8.89,-0.635; IP+@4 8.175,-1.625; IP+@5 7,-2; IP+@6 5.675,-2; IP+@7 4.35,-2; IP+@8 3,-2; IP+@9 1.825,-1.625; IP+@10 1.1,-0.625; IP+@11 1.1,0.625; IP+@12 1.825,1.625; IP+@13 3,2; IP+@14 4.35,2; IP+@15 5.675,2; IP+@16 7,2; IP+@17 8.175,1.625; IP-@2 -8.89,0.635; IP-@3 -8.89,-0.635; IP-@4 -8.175,-1.625; IP-@5 -7,-2; IP-@6 -5.675,-2; IP-@7 -4.325,-2; IP-@8 -3,-2; IP-@9 -1.825,-1.625; IP-@10 -1.1,-0.625; IP-@11 -1.1,0.625; IP-@12 -1.825,1.625; IP-@13 -3,2; IP-@14 -4.325,2; IP-@15 -5.675,2; IP-@16 -7,2; IP-@17 -8.175,1.625
SOP50P490X110-10N = smd 1.4 x 0.3: 1 -2.2,1; 2 -2.2,0.5; 3 -2.2,0; 4 -2.2,-0.5; 5 -2.2,-1; 6 2.2,-1; 7 2.2,-0.5; 8 2.2,0; 9 2.2,0.5; 10 2.2,1
SOIC8 = smd 0.6 x 2.2: 1 -1.905,-2.6; 2 -0.635,-2.6; 3 0.635,-2.6; 4 1.905,-2.6; 5 1.905,2.6; 6 0.635,2.6; 7 -0.635,2.6; 8 -1.905,2.6
SOT65P210X110-5N = smd 1.2 x 0.4: 1 -0.95,0.65; 2 -0.95,0; 3 -0.95,-0.65; 4 0.95,-0.65; 5 0.95,0.65
MOLEX_172042-0406 = drill 1 pad 3.2 long: 1 7.508,2.075; 2 0,2.075; 3 -7.508,2.075 | hole 3: 12.298,0.27; -12.298,0.27
R0805 = smd 1.3 x 1.5: 1 -0.95,0; 2 0.95,0
M0805 = smd 1.3 x 1.6: 1 -0.95,0; 2 0.95,0
TFC44 = drill 0.9: P$1 -1.905,4.45; P$2 -0.635,1.905; P$3 0.635,4.45; P$4 1.905,1.905 | hole 3.5: -3.5,-4.445; 3.8,-4.445
TTGOBEAM = drill 0.6: 0 11.9,5.8; 2 -13,-9.8; 3.3V 11.9,-9.8; 3V3 11.9,0.6; 4 11.9,8.4; 5V -13,-15; 13 -13,-7.2; 14 -13,-4.6; 21 11.9,-7.2; 22 11.9,-4.6; 23 11.9,11; 25 -13,-2; 32 -13,3.2; 33 -13,0.6; 34 -13,8.4; 35 -13,5.8; 36 -13,16.2; 39 -13,13.6; GND -13,-12.4; GND1 11.9,-2; GND3 11.9,3.2; LORA1 11.9,-15; LORA2 11.9,-12.4; RST -13,11; RX 11.9,13.6; TX 11.9,16.2
DC-DC-STEP-DOWN-LM2596 = drill 1.5 pad 2.5 square: IN+ -19.812,8.636; IN- -19.812,-8.636; OUT+ 19.812,8.636; OUT- 19.812,-8.636 | hole 3: -14.478,7.62; 15.24,-7.62
XT60 = drill 5 octagon: + 4.5,0; - 11.5,0

### Placement (x,y rotation side)
BBANK  84.45,64.14 180 top
C1  139.83,29.97 0 top
C2  139.83,27.43 0 top
C3  130.56,26.92 0 top
C4  130.56,30.1 0 top
C5  134.37,29.97 270 top
C6  93.09,35.56 0 top
C7  102.23,41.91 270 top
C8  47.75,33.4 0 top
C9  55.37,32.38 270 top
C10  68.58,53.59 0 top
C11  87.25,51.69 180 top
C12  76.2,53.34 270 top
C13  112.39,64.14 180 top
C14  138.43,47.62 0 top
C15  129.79,52.32 90 top
C16  4.45,40.01 270 top
C17  38.1,45.72 180 top
C18  33.02,48.9 0 top
D1  17.78,67.31 90 top
D2  17.78,59.69 90 top
EX1  110,6 0 top
EX2  125,6 0 top
EX3  140,6 0 top
IC1  139.7,35.56 270 top
IC2  130.18,34.29 90 top
IC3  95.25,40.64 180 top
IC4  48.64,57.4 0 top
IC5  68.58,50.16 180 top
IC6  140.34,52.07 90 top
IC7  7.62,45.09 180 top
IC8  37.47,48.26 0 top
J1  153.67,58.42 90 top
MSHUNT  150.5,35.56 90 top
R1  134.62,38.73 90 top
R2  126.87,37.21 270 top
R3  134.37,34.04 90 top
R4  54.36,35.81 0 top
R5  90.68,55.5 270 top
R6  87.25,54.48 180 top
R7  76.2,57.91 270 top
R8  73.66,53.34 270 top
R9  116.2,66.04 270 top
R10  112.39,60.96 180 top
R11  137.79,57.15 270 top
R12  13.34,42.55 270 top
R13  10.79,40.01 270 top
R14  7.62,49.53 0 top
R15  133.35,51.44 180 top
R16  13.46,46.74 270 top
R17  33.02,46.35 180 top
RJ11_1  8.89,62.23 0 top
RJ11_2  26.67,62.23 0 top
U$1  24.13,19.68 90 top
U$2  114.3,50.16 270 top
U$3  56.64,67.06 180 top
VPV  69.22,64.14 180 top

### Tracks (layer width: path | path; a pad name or v marks a point on that pad's centre or on a via)
12V_CM
  Top 0.305: C15.1 129.85,51.44 R15.2 132.4,47.94 137.16,43.18 154.94,43.18 157.48,40.64 157.48,24.77 149.86,17.14 40.34,17.14 31.33,8.13 U$1.13
12V_CURRENT_M
  Top 0.61: IC6.1 IC6.2
  Top 2.54: IC6.1 150.85,50.16 J1.3
  pour Top (no thermals): 141.35,51.31 141.35,49.91 143,48.26 154.31,48.26 154.94,48.9 154.94,50.8 154.05,51.69 141.73,51.69
12V_VM
  Top 0.305: R10.1 115.57,60.96 134.24,42.29 153.29,42.29 156.21,39.37 156.21,26.04 148.59,18.41 35.2,18.41 26.81,10.02 26.64,9.86 23.53,6.75 U$1.33
  Top 0.508: R9.2 115.25,64.14 C13.1 R10.1
!RXEN
  Top 0.305: IC7.2 12.38,44.45 R12.1 14.29,43.49 14.99,42.79 14.99,37.85 13.13,35.99 U$1.23
BBANK_AIN0
  Top 0.305: IC5.4 72.53,50.66 73.66,49.53 87,49.53 88.2,50.73 C11.1
  Top 0.508: C11.1 R6.1 88.27,54.55 R5.2
CMPPT_F
  Top 0.305: C9.1 55.31,33.4 R4.2
  Top 0.406: U$1.32 34.56,20.32 40.09,20.32 53.1,33.33 C9.1
CMPPT_M  (via drill 0.35)
  Top 5.08: IC4.IP- 41.64,63.55 U$3.-
  other vias: 37.47,55.24 37.47,59.05 39.37,60.96 37.47,62.87 41.27,62.87 39.37,64.77 37.47,66.67 41.27,66.67 39.37,68.58 44.45,61.59 46.35,62.87 41.27,70.48 39.37,72.39 37.47,70.48 43.81,72.39 46.35,71.12
  pour Top (no thermals): 36.58,54.36 36.58,73.53 48.01,73.53 48.01,54.36
  pour Bottom (no thermals): 36.58,54.36 36.58,73.53 48.01,73.53 48.01,54.36
CMPPT_OUT
  Top 0.305: R4.1 50.74,35.81 IC4.3
CMPPT_P  (via drill 0.35)
  Top 5.08: IC4.IP+ 55.64,63.56 U$3.+
  other vias: 51.44,71.12 50.8,62.87 53.34,61.59 55.88,62.87 57.78,60.96 59.69,59.05 59.69,62.87 57.78,64.77 55.88,66.67 59.69,66.67 57.78,68.58 55.88,70.48 53.98,72.39 57.78,72.39 59.69,70.48 59.69,55.24
  pour Top (no thermals): 60.71,73.53 60.71,54.36 49.28,54.36 49.28,73.53
  pour Bottom (no thermals): 49.28,73.53 49.28,54.36 60.71,54.36 60.71,73.53
CONEX_11
  Top 0.305: U$1.25 26.13,5.42 27.05,4.5 112.35,4.5 EX1.1
CONEX_12
  Top 0.305: EX1.2 110.06,5.21 29.57,5.21 28.73,6.05 U$1.14
CONEX_21
  Top 0.305: U$1.34 15.73,5.42 17.97,3.17 126.03,3.17 EX2.1
CONEX_22
  Top 0.305: U$1.35 18.33,5.42 19.93,3.81 123.67,3.81 EX2.2
CONEX_31
  Top 0.305: U$1.36 7.93,5.42 11.44,1.91 139.76,1.91 EX3.1
CONEX_32
  Top 0.305: U$1.39 10.53,5.42 13.4,2.54 137.4,2.54 EX3.2
GND  (via drill 0.35)
  Top 0.305: IC8.2 34.6,48.26 C18.2 | C17.2 36.01,44.58 v35.43,44.58 | C8.2 48.7,35.94 IC4.2 | C9.2 56.2,31.43 v57.15,30.48 | R8.2 C12.2 v76.2,50.8 | IC5.3 v69.22,50.16 | IC5.1 69.53,49.16 69.22,49.48 v69.22,50.16 | C10.2 70.17,54.23 v71.12,54.23 | C3.2 131.51,28.57 | 131.51,28.57 C4.2 131.45,30.16 131.45,30.83 130.18,32.1 IC2.2 | 131.51,28.57 v132.21,28.57 133.92,28.57 C5.2 | IC1.7 140.34,30.41 C1.2 140.78,28.57 | C2.2 140.78,28.57 | 140.78,28.57 142.24,28.57 v142.37,28.45 | C10.2 69.53,56.31 67.47,58.38 VPV.2 | v69.22,50.16 69.22,53.28 C10.2 | R6.2 86.3,53.14 C11.2 | C15.2 v129.79,55.12 | IC1.2 140.34,39.12 v141.35,40.13 | C14.2 v140.97,47.62 | IC6.5 v135.89,53.98 | RJ11_1.P$3 12.21,69.36 D1.2 | D2.2 17,61.74 v15.88,62.87
  Top 0.406: IC7.5 v3.43,46.99 | v6.02,39.12 5.96,39.05 C16.2 | R16.1 13.34,47.81 v13.34,49.28 | 86.3,53.14 83.9,53.14 v83.87,53.11
  Top 0.508: IC1.2 v140.34,35.56 IC1.7 | C6.2 96.23,37.75 96.82,38.34 IC3.1 | C18.2 33.97,49.21 v35.56,50.8
  Top 0.813: 96.23,37.75 96.23,37.81 v96.27,37.85 | v103.5,40.01 103.44,40.01 102.49,40.96 C7.2
  Top 1.27: R10.2 C13.2 109.73,65.85 v109.73,65.91
  Bottom 0.508: 97.92,30.35 U$2.OUT-
  Bottom 0.61: 83.87,50.16 v83.87,53.11 83.87,59.12 BBANK.2 | v71.12,54.23 67.47,57.88 VPV.2 | EX2.4 128.32,14.55 126.36,16.51 | 126.36,16.51 112.52,30.35 U$2.OUT- 113.33,22.69 EX1.4 | EX3.4 143.32,14.15 140.97,16.51 126.36,16.51 | v142.37,28.45 138.56,28.45 132.08,34.92
  Bottom 0.813: v69.22,50.16 75.56,50.16 | 75.56,50.16 v76.2,50.8 | 75.56,50.16 71.5,54.23 v71.12,54.23 | 75.56,50.16 83.87,50.16 83.95,50.16 v96.27,37.85 103.76,30.35 U$2.OUT- | 126.36,34.92 132.21,29.08 v132.21,28.57 | 138.43,34.92 139.7,34.92 v140.34,35.56 | 134.62,34.92 139.83,40.13 v141.35,40.13 | v35.43,44.58 45.09,44.58 | 45.09,44.58 83.69,44.58 97.92,30.35 | v35.56,50.8 38.73,50.8 | 40.39,49.28 38.86,50.8 38.73,50.8 | 45.09,44.58 40.39,49.28 | v13.34,49.28 22.86,49.28 | 22.86,49.28 26.67,49.28 | 26.67,49.28 40.39,49.28 | 22.86,49.28 15.88,56.26 v15.88,62.87 12.06,66.68 RJ11_1.P$3 | v6.02,39.12 6.02,41.91 | v3.43,46.99 2.92,46.48 2.92,41.91 6.02,41.91 | 6.02,41.91 19.3,41.91 26.67,49.28 | RJ11_2.P$3 28.57,66.68 34.92,60.33 34.92,54.61 38.73,50.8 | 60.33,27.94 59.69,27.94 v57.15,30.48
  Bottom 1.016: U$2.IN- v109.73,65.91 115.32,60.33 133.99,60.33 139.59,65.93 J1.1 | 126.36,34.92 132.08,34.92 134.62,34.92 138.43,34.92
  Bottom 1.27: 126.36,34.92 115.88,34.92 | U$2.OUT- 111.31,30.35 115.88,34.92 | U$2.OUT- 103.25,27.94 60.33,27.94 26.67,27.94 | U$1.GND3 20.93,29.87 22.86,27.94 26.67,27.94 | 26.67,27.94 26.13,28.48 U$1.GND1 | U$1.GND 36.53,7.96 52.7,24.13 100.97,24.13 105.66,28.83 U$2.OUT- | 115.88,34.92 130.01,49.06 | 130.01,49.06 130.65,49.69 | 130.65,49.69 134.93,53.98 v135.89,53.98 | 130.01,49.06 130.01,54.9 v129.79,55.12 | 130.65,49.69 138.9,49.69 v140.97,47.62 | U$2.OUT- 103.5,32.51 v103.5,40.01 103.5,48.51 115.32,60.33 | U$2.OUT- 91.57,30.35 82.55,39.37 50.8,39.37 48.64,37.21 IC4.2
  pour Top (rank 2): 0,74.3 0,0 160.66,0 160.66,74.3
  pour Bottom (isolate 0.406, rank 2): -0.64,74.3 0,74.93 160.66,74.93 161.29,74.3 161.29,0 160.66,-0.64 0,-0.64 -0.64,0
I2C_SCL
  Top 0.305: R2.1 117.79,47.24 69.57,47.24 67.65,49.16 IC5.10 65.62,49.16 65.47,49.01 49.01,49.01 38.1,38.1 34.92,38.1 28.73,31.91 U$1.22
  Top 0.508: IC2.5 129.25,35.56 129.25,36.74 127.83,38.16 R2.1
I2C_SDA
  Top 0.305: 132.24,37.31 121.54,48.01 69.7,48.01 68.04,49.66 IC5.9 48.4,49.66 38.1,39.37 34.21,39.37 27.48,32.64 27.48,30.76 28.17,30.07 30.66,30.07 31.33,30.75 U$1.21
  Top 0.508: IC2.4 131.12,36.2 132.24,37.31 132.72,37.78 R1.1
MSHUNT_ADC
  Top 0.305: C5.1 R3.1 134.32,33.04 IC2.3
MSHUNT_AMP
  Top 0.305: R3.2 136.46,34.99 137.79,33.66 IC1.5
MSHUNT_B
  Top 0.508: IC1.8 145.68,32.85 MSHUNT.1
MSHUNT_M
  Top 0.508: IC1.1 145.68,38.27 MSHUNT.2
N$1
  Top 0.305: IC6.6 139.06,52.7 139.7,53.34 139.7,55.24 138.75,56.2 R11.2
N$2
  Top 0.305: R15.1 IC6.7
N$3
  Top 0.305: R17.1 34.6,46.35 35.88,47.63 36.5,47.63 IC8.3
PV_AIN1
  Top 0.305: IC5.5 71.16,51.16 71.54,51.55 71.54,52.75 73.09,54.29 R8.1 C12.1 R7.2
RS485_A
  Top 0.305: IC7.6 5.97,45.72 6.61,46.36 6.61,49.47 R14.1 6.67,52.39 8.31,54.03 8.31,58.99 8.26,59.05 RJ11_1.P$2 9.53,65.41 17.64,65.41 D1.1 18.41,65.26 19.54,64.14 RJ11_2.P$2
RS485_B
  Top 0.305: IC7.7 5.71,44.45 8.57,47.3 R14.2 9.67,49.53 D2.1 | D2.1 11.29,64.14 RJ11_1.P$4 | D2.1 21.73,61.59 26.67,61.59 28.57,63.5 RJ11_2.P$4
TEMP1
  Top 0.406: U$1.0 18.33,33.25 31.43,46.35 R17.2 C18.1
TXEN
  Top 0.305: U$1.4 15.86,31.71 15.86,43.83 13.9,45.79 R16.2 13.4,45.72 IC7.3
UART_RX
  Top 0.406: 10.33,41.47 IC7.1 | R13.1 10.33,41.42 10.33,41.47 | U$1.RX 10.53,34.76 9.21,36.08 9.21,40.34 10.33,41.47
UART_TX
  Top 0.305: U$1.TX 7.93,45.4 9.53,46.99 IC7.4
VCC_3V3  (via drill 0.35)
  Top 0.305: R13.2 13.02,39.05 13.34,39.37 R12.2 | C17.1 39.05,46.98 IC8.4 | C8.1 46.8,35.93 IC4.1 | IC5.8 67.31,50.16 67.94,50.8 67.94,53.28 C10.1 | R11.1 138.75,58.1 140.34,56.52 140.34,51.44 139.06,50.16 IC6.8 | RJ11_2.P$1 20.32,71.12 11.43,71.12 RJ11_1.P$1 1.27,60.97 1.27,45.89 3.98,43.18 IC7.8
  Top 0.406: 2.59,35.56 3.86,36.83 v6.99,36.83
  Top 0.508: IC1.3 139.06,39.5 138.24,40.32 135.25,40.32 R1.2 | C6.1 IC3.4 | R13.2 10.79,37.47 v10.16,36.83
  Top 0.61: C1.1 139,30.1 139,32.79 IC1.6 IC1.3 139.06,40.64 v138.43,41.27 | v135.89,47.62 C14.1 | C3.1 C4.1 129.61,30.73 129.16,31.18 129.16,32.98 IC2.1 127.61,33.04 127,33.66 | C10.1 66.93,53.59 v64.14,50.8 | v64.77,47.62 66.29,46.1 86.67,46.1 IC3.4 | IC7.8 4.45,42.72 C16.1 | v138.43,44.02 137.48,44.97 C14.1 | C14.1 137.48,49.91 IC6.8
  Top 0.813: C16.1 3.12,40.95 2.59,40.42 2.59,35.56 2.59,32.33 6.35,28.57 23.53,28.57 | 23.53,28.57 U$1.3V3 23.53,32.22 33.22,41.91 36.83,41.91 39.05,44.13 C17.1 | U$1.3.3V 33.93,30.12 32.38,28.57 23.53,28.57 | IC4.1 46.7,36.04 | IC3.4 IC3.2
  Top 1.016: C1.1 C2.1 138.88,25.85 137.16,24.13 129.54,24.13 127,26.67 127,33.66 127,34.29 125.03,36.26 | IC3.4 92.15,43.26 93.98,45.09 116.2,45.09 125.03,36.26 | R2.2 125.03,36.26
  Top 1.27: 46.7,36.04 46.7,38.17 49.15,40.63 | 49.15,40.63 IC3.4 | U$1.3.3V 33.93,33.3 36.2,35.56 40.64,35.56 45.71,40.63 49.15,40.63
  Bottom 0.406: v10.16,36.83 v6.99,36.83
  Bottom 0.61: v64.14,50.8 64.14,48.26 v64.77,47.62 | v138.43,41.27 v138.43,44.02
VCC_5V  (via drill 0.35)
  Top 1.016: U$2.OUT+ 122.94,33.91 113.98,42.86 C7.1 102.16,42.94 IC3.3
  Top 1.27: 102.23,13.46 104.14,15.36 113.55,15.36 | 100.97,13.46 45.9,13.46 U$1.5V | 100.97,13.46 102.23,13.46 | 102.23,13.46 v102.23,15.24 | 100.97,13.46 v100.97,15.24 | v103.25,21.08 112.52,30.35 U$2.OUT+ 114.17,30.35 v104.14,20.32 | EX1.3 116.33,12.58 113.55,15.36 | 113.55,15.36 128.78,15.36 | EX2.3 131.32,12.82 128.78,15.36 | 128.78,15.36 145.29,15.36 146.32,14.33 EX3.3
  Bottom 1.27: v102.23,15.24 102.23,18.41 | 102.23,18.41 v104.14,20.32 | 102.23,18.41 100.97,17.14 v100.97,15.24 100.97,18.8 v103.25,21.08
VCC_12V
  Top 0.508: R9.1 119.19,69.98 U$2.IN+
  Top 0.61: IC6.3 IC6.4
  Top 1.016: IC6.4 143.51,54.55 143.51,58.42 131.95,69.98 U$2.IN+
  Top 2.54: IC6.4 147.38,58.42 J1.2
  pour Top (no thermals): 141.6,52.45 146.56,52.45 150.24,56.13 154.56,56.13 155.57,57.15 155.57,58.42 154.31,59.69 146.05,59.69 141.35,54.99 141.35,52.7
VCC_BBANK
  Top 0.508: R5.1 86.84,60.28 BBANK.1
VCC_PV
  Top 0.305: VPV.1 74.78,60.28 R7.1

### Text on the board
tPlace: E.C-E.N-G.P-G.G-J.A
bPlace: Telemetria e Gerenciamento Energético / Projeto Solares | TGE NEIL v1.0 / 26/08/2021